# Altium schematic sheet Step_Driver.SchDoc
size 420 x 297 mm; Address1: Address1; Address2: Address2; Address3: Address3; Address4: Address4; DocumentNumber: АБВГ.123456.001 Э3; SheetNumber: 1; Scale: 1:1; DocumentType: Схема электрическая принципиальная; FirstReferrence: АБВГ.123456.001
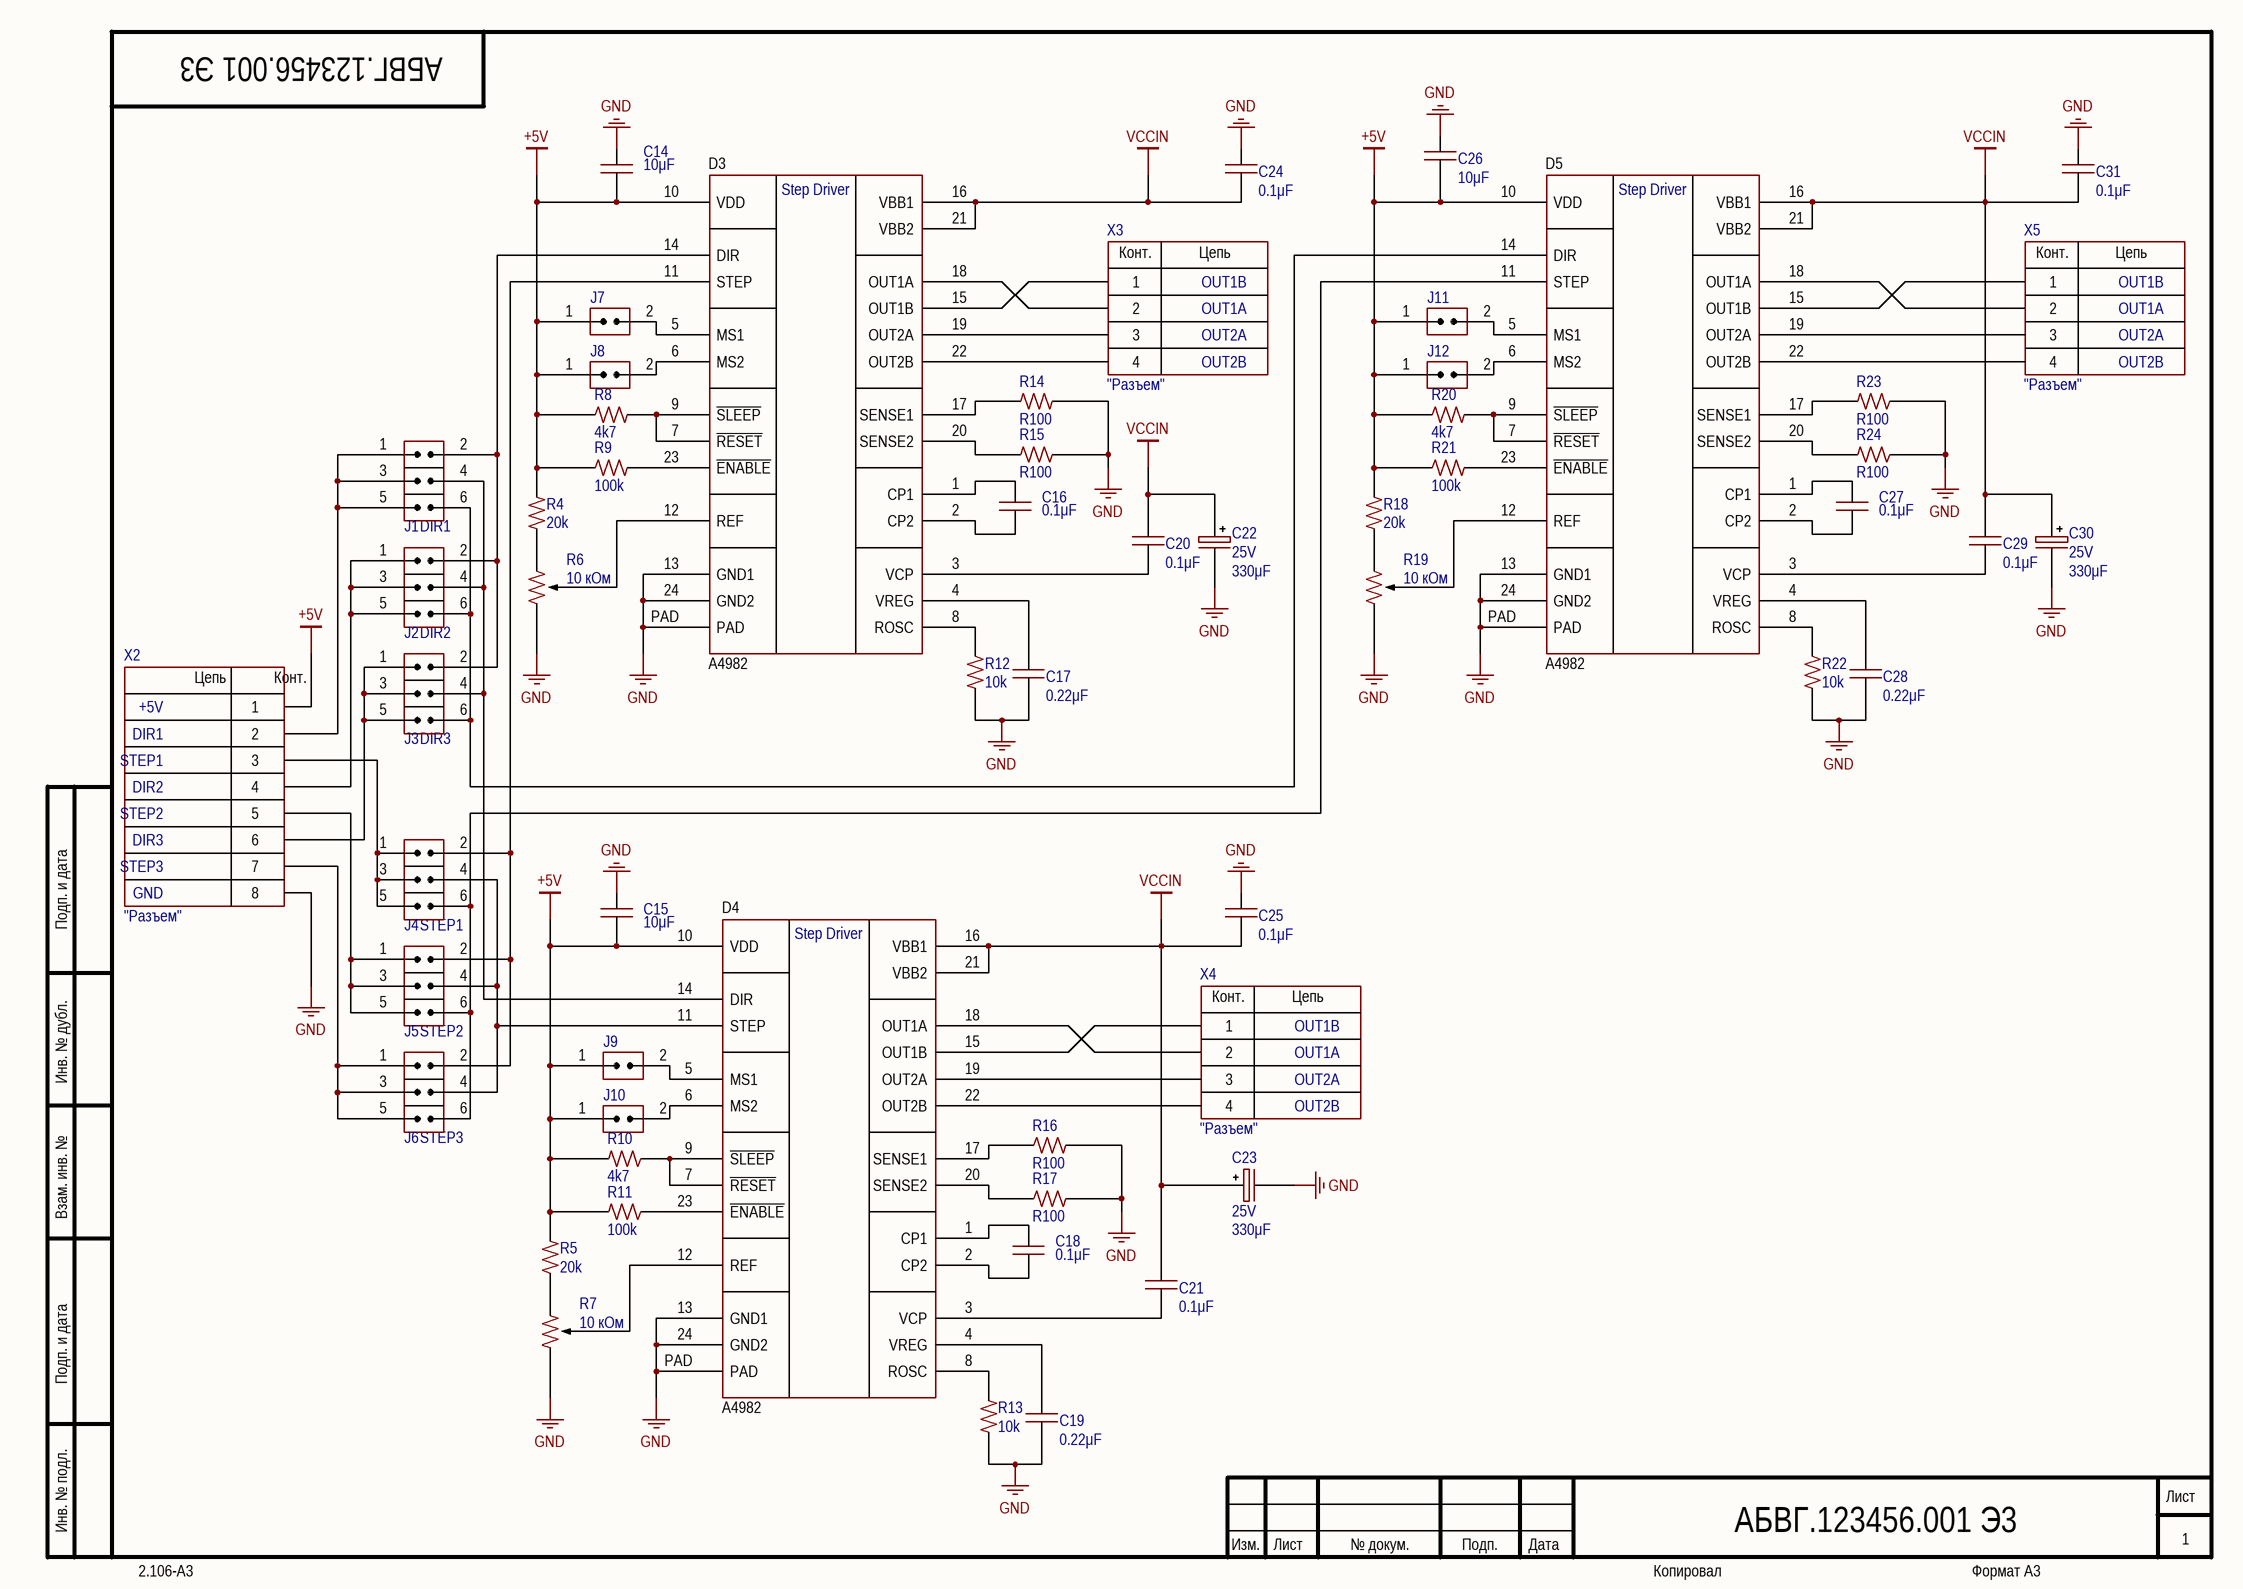
[diagram p0: Step_Driver.SchDoc]

## Parts
C14  Значение: 10μF  [CAP: 0805]  (hidden comment: Керамический SMD)
C15  Значение: 10μF  [CAP: 0805]  (hidden comment: Керамический SMD)
C16  Значение: 0.1μF  [CAP: 0805]  (hidden comment: Керамический SMD)
C17  Значение: 0.22μF  [CAP: 0805]  (hidden comment: Керамический SMD)
C18  Значение: 0.1μF  [CAP: 0805]  (hidden comment: Керамический SMD)
C19  Значение: 0.22μF  [CAP: 0805]  (hidden comment: Керамический SMD)
C20  Значение: 0.1μF  [CAP: 0805]  (hidden comment: Керамический SMD)
C21  Значение: 0.1μF  [CAP: 0805]  (hidden comment: Керамический SMD)
C22  Напряжение: 25V  Значение: 330μF  [CAP: SMD D6.3A6.6H7.7]
C23  Напряжение: 25V  Значение: 330μF  [CAP: SMD D6.3A6.6H7.7]
C24  Значение: 0.1μF  [CAP: 0805]  (hidden comment: Керамический SMD)
C25  Значение: 0.1μF  [CAP: 0805]  (hidden comment: Керамический SMD)
C26  Значение: 10μF  [CAP: 0805]  (hidden comment: Керамический SMD)
C27  Значение: 0.1μF  [CAP: 0805]  (hidden comment: Керамический SMD)
C28  Значение: 0.22μF  [CAP: 0805]  (hidden comment: Керамический SMD)
C29  Значение: 0.1μF  [CAP: 0805]  (hidden comment: Керамический SMD)
C30  Напряжение: 25V  Значение: 330μF  [CAP: SMD D6.3A6.6H7.7]
C31  Значение: 0.1μF  [CAP: 0805]  (hidden comment: Керамический SMD)
D3  A4982  [24-TSSOP-PAD]
D4  A4982  [24-TSSOP-PAD]
D5  A4982  [24-TSSOP-PAD]
J1  CommentText: DIR1  [CON: JUMPER x3]
J2  CommentText: DIR2  [CON: JUMPER x3]
J3  CommentText: DIR3  [CON: JUMPER x3]
J4  CommentText: STEP1  [CON: JUMPER x3]
J5  CommentText: STEP2  [CON: JUMPER x3]
J6  CommentText: STEP3  [CON: JUMPER x3]
J7  (no value)  [CON: JUMPER x1]
J8  (no value)  [CON: JUMPER x1]
J9  (no value)  [CON: JUMPER x1]
J10  (no value)  [CON: JUMPER x1]
J11  (no value)  [CON: JUMPER x1]
J12  (no value)  [CON: JUMPER x1]
R4  Значение: 20k  [RES: 0805]  (hidden comment: Резистор SMD)
R5  Значение: 20k  [RES: 0805]  (hidden comment: Резистор SMD)
R6  Значение: 10 кОм  [RES: 3296W]  (hidden comment: Резистор подстроечный)
R7  Значение: 10 кОм  [RES: 3296W]  (hidden comment: Резистор подстроечный)
R8  Значение: 4k7  [RES: 0805]  (hidden comment: Резистор SMD)
R9  Значение: 100k  [RES: 0805]  (hidden comment: Резистор SMD)
R10  Значение: 4k7  [RES: 0805]  (hidden comment: Резистор SMD)
R11  Значение: 100k  [RES: 0805]  (hidden comment: Резистор SMD)
R12  Значение: 10k  [RES: 0805]  (hidden comment: Резистор SMD)
R13  Значение: 10k  [RES: 0805]  (hidden comment: Резистор SMD)
R14  Значение: R100  [RES: 2010]  (hidden comment: Резистор SMD)
R15  Значение: R100  [RES: 2010]  (hidden comment: Резистор SMD)
R16  Значение: R100  [RES: 2010]  (hidden comment: Резистор SMD)
R17  Значение: R100  [RES: 2010]  (hidden comment: Резистор SMD)
R18  Значение: 20k  [RES: 0805]  (hidden comment: Резистор SMD)
R19  Значение: 10 кОм  [RES: 3296W]  (hidden comment: Резистор подстроечный)
R20  Значение: 4k7  [RES: 0805]  (hidden comment: Резистор SMD)
R21  Значение: 100k  [RES: 0805]  (hidden comment: Резистор SMD)
R22  Значение: 10k  [RES: 0805]  (hidden comment: Резистор SMD)
R23  Значение: R100  [RES: 2010]  (hidden comment: Резистор SMD)
R24  Значение: R100  [RES: 2010]  (hidden comment: Резистор SMD)
X2  CommentText: "Разъем"  [CON: PLS-8]
X3  CommentText: "Разъем"  [CON: 15EDGVC-3.5-04]
X4  CommentText: "Разъем"  [CON: 15EDGVC-3.5-04]
X5  CommentText: "Разъем"  [CON: 15EDGVC-3.5-04]

## Nets
+5V: C14.1 C15.1 C26.1 D3.10(VDD) D4.10(VDD) D5.10(VDD) J7.1(IN) J8.1(IN) J9.1(IN) J10.1(IN) J11.1(IN) J12.1(IN) R4.2 R5.2 R8.1 R9.1 R10.1 R11.1 R18.2 R20.1 R21.1 X2.1
GND: C14.2 C15.2 C17.1 C19.1 C22.2 C23.2 C24.1 C25.1 C26.2 C28.1 C30.2 C31.1 D3.13(GND1) D3.24(GND2) D3.PAD D4.13(GND1) D4.24(GND2) D4.PAD D5.13(GND1) D5.24(GND2) D5.PAD R6.3 R7.3 R12.1 R13.1 R14.2 R15.2 R16.2 R17.2 R19.3 R22.1 R23.2 R24.2 X2.8
VCCIN: C20.2 C21.2 C22.1 C23.1 C24.2 C25.2 C29.2 C30.1 C31.2 D3.16(VBB1) D3.21(VBB2) D4.16(VBB1) D4.21(VBB2) D5.16(VBB1) D5.21(VBB2)
NetC16_1: C16.1 D3.2(CP2)
NetC16_2: C16.2 D3.1(CP1)
NetC17_2: C17.2 D3.4(VREG)
NetC18_1: C18.1 D4.2(CP2)
NetC18_2: C18.2 D4.1(CP1)
NetC19_2: C19.2 D4.4(VREG)
NetC20_1: C20.1 D3.3(VCP)
NetC21_1: C21.1 D4.3(VCP)
NetC27_1: C27.1 D5.2(CP2)
NetC27_2: C27.2 D5.1(CP1)
NetC28_2: C28.2 D5.4(VREG)
NetC29_1: C29.1 D5.3(VCP)
NetD3_5: D3.5(MS1) J7.2(IN)
NetD3_6: D3.6(MS2) J8.2(IN)
NetD3_7: D3.7(~{RESET}) D3.9(~{SLEEP}) R8.2
NetD3_8: D3.8(ROSC) R12.2
NetD3_11: D3.11(STEP) J4.2(IN) J5.2(IN) J6.2(IN)
NetD3_12: D3.12(REF) R6.2
NetD3_14: D3.14(DIR) J1.2(IN) J2.2(IN) J3.2(IN)
NetD3_15: D3.15(OUT1B) X3.1
NetD3_17: D3.17(SENSE1) R14.1
NetD3_18: D3.18(OUT1A) X3.2
NetD3_19: D3.19(OUT2A) X3.3
NetD3_20: D3.20(SENSE2) R15.1
NetD3_22: D3.22(OUT2B) X3.4
NetD3_23: D3.23(~{ENABLE}) R9.2
NetD4_5: D4.5(MS1) J9.2(IN)
NetD4_6: D4.6(MS2) J10.2(IN)
NetD4_7: D4.7(~{RESET}) D4.9(~{SLEEP}) R10.2
NetD4_8: D4.8(ROSC) R13.2
NetD4_11: D4.11(STEP) J4.4(IN) J5.4(IN) J6.4(IN)
NetD4_12: D4.12(REF) R7.2
NetD4_14: D4.14(DIR) J1.4(IN) J2.4(IN) J3.4(IN)
NetD4_15: D4.15(OUT1B) X4.1
NetD4_17: D4.17(SENSE1) R16.1
NetD4_18: D4.18(OUT1A) X4.2
NetD4_19: D4.19(OUT2A) X4.3
NetD4_20: D4.20(SENSE2) R17.1
NetD4_22: D4.22(OUT2B) X4.4
NetD4_23: D4.23(~{ENABLE}) R11.2
NetD5_5: D5.5(MS1) J11.2(IN)
NetD5_6: D5.6(MS2) J12.2(IN)
NetD5_7: D5.7(~{RESET}) D5.9(~{SLEEP}) R20.2
NetD5_8: D5.8(ROSC) R22.2
NetD5_11: D5.11(STEP) J4.6(IN) J5.6(IN) J6.6(IN)
NetD5_12: D5.12(REF) R19.2
NetD5_14: D5.14(DIR) J1.6(IN) J2.6(IN) J3.6(IN)
NetD5_15: D5.15(OUT1B) X5.1
NetD5_17: D5.17(SENSE1) R23.1
NetD5_18: D5.18(OUT1A) X5.2
NetD5_19: D5.19(OUT2A) X5.3
NetD5_20: D5.20(SENSE2) R24.1
NetD5_22: D5.22(OUT2B) X5.4
NetD5_23: D5.23(~{ENABLE}) R21.2
NetJ1_1: J1.1(IN) J1.3(IN) J1.5(IN) X2.2
NetJ2_1: J2.1(IN) J2.3(IN) J2.5(IN) X2.4
NetJ3_1: J3.1(IN) J3.3(IN) J3.5(IN) X2.6
NetJ4_1: J4.1(IN) J4.3(IN) J4.5(IN) X2.3
NetJ5_1: J5.1(IN) J5.3(IN) J5.5(IN) X2.5
NetJ6_1: J6.1(IN) J6.3(IN) J6.5(IN) X2.7
NetR4_1: R4.1 R6.1
NetR5_1: R5.1 R7.1
NetR18_1: R18.1 R19.1

## Notes on the sheet
- OUT1B
- OUT1A
- OUT2A
- OUT2B
- +5V
- DIR1
- STEP1
- DIR2
- STEP2
- DIR3
- STEP3
- GND
- Подп. и дата
- Инв. № дубл.
- Взам. инв. №
- Инв. № подл.
- Изм.
- Лист
- № докум.
- Подп.
- Дата
- 2.106-A3
- Копировал
- Формат А3
- (in symbol A4982) Step Driver
- (in symbol Connector_terminal_4pin) Конт.; Цепь
- (in symbol PLS-8) Цепь; Конт.

## Library data of the parts
C14-C21 C24-C29 C31 = Керамический SMD: Производитель: Yageo; УникальныйНомер: CC0201KRX7R7BB103; Типоразмер: 0201; Ссылка: ***; ТипКомпонента: Ceramic capacitor; Точность: ±10%; ТипДиэлектрика: X7R; Напряжение: 16V
C22 C23 C30 = Алюминиевые: Производитель: Wurth; УникальныйНомер: 860080475013; Типоразмер: 14x10x5 mm; Ссылка: ***; ТипКомпонента: Aluminium capacitor; Точность: ±20%
D3-D5 = A4982: Драйвер шагового двигателя; Производитель: UMW(Youtai Semiconductor Co., Ltd.); Ссылка: ***; Типоразмер: SOIC 8; ТипКомпонента: Battery Charger; УникальныйНомер: A4982
J1-J6 = Jumper_6_pin
J7-J12 = Jumper_2_pin: CommentText: "Перемычка"
R4 R5 R8-R18 R20-R24 = Резистор SMD: Производитель: YAGEO; УникальныйНомер: RC0201JR-07100RL; Типоразмер: 0201; Ссылка: ***; Точность: ±5%; ТипКомпонента: Резистор SMD
R6 R7 R19 = Резистор подстроечный: Производитель: Bourns; УникальныйНомер: 3296W-1-103LF; Типоразмер: 3296W; Ссылка: ***; ТипКомпонента: Resistor film; Точность: ±10%
X2 = PLS-8: Manufacturer: Connfly; ValueManufacturerPartNumber: Connector, 8pin, 2.54mm, 500VAC, 3A; TypeConnector: Connector; VoltageMax: 500VAC; Pitch: 2.54mm; CurrentMax: 3A; Multichannel: 8pin; HelpURL: https://www.chipdip.ru/product/pls-8-ds1021-1-8sf112; PartNumber: PLS-8
X3-X5 = Connector_terminal_4pin: Manufacturer: Degson; ValueManufacturerPartNumber: Terminal connector, 6pin, 3.5mm, 300VAC, 10A; PartNumber: DG350-3.5-06P-14; TypeConnector: Terminal connector; VoltageMax: 300VAC; Pitch: 3.5mm; CurrentMax: 10A; Multichannel: 6pin; HelpURL: https://www.compel.ru/infosheet/DEGSON/DG350-3.5-06P-14-00AH